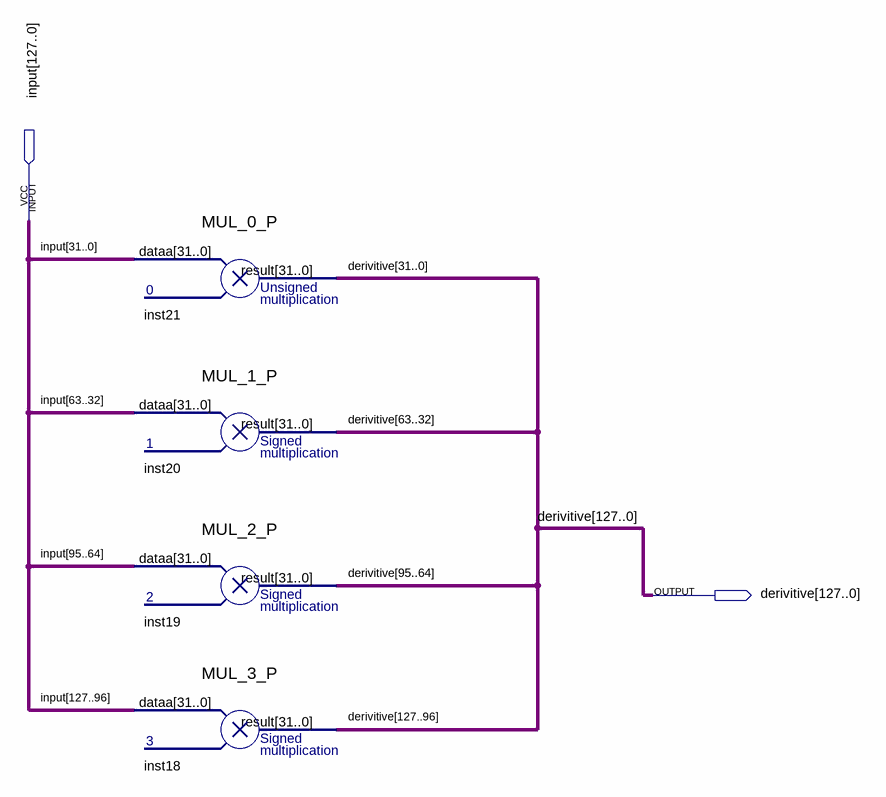
[diagram p0: schematic sheet]
// Quartus schematic derivitivePolynomial.bdf as structural Verilog: 4 symbols, 2 pins
module derivitivePolynomial (
  input  [127:0] \input ,
  output [127:0] derivitive
);

  MUL_0_P inst21 (.dataa(\input [31:0]), .result(derivitive[31:0]));
  MUL_1_P inst20 (.dataa(\input [63:32]), .result(derivitive[63:32]));
  MUL_2_P inst19 (.dataa(\input [95:64]), .result(derivitive[95:64]));
  MUL_3_P inst18 (.dataa(\input [127:96]), .result(derivitive[127:96]));
endmodule
